# EAGLE design Chiqoo2 (EAGLE 6.6.0)
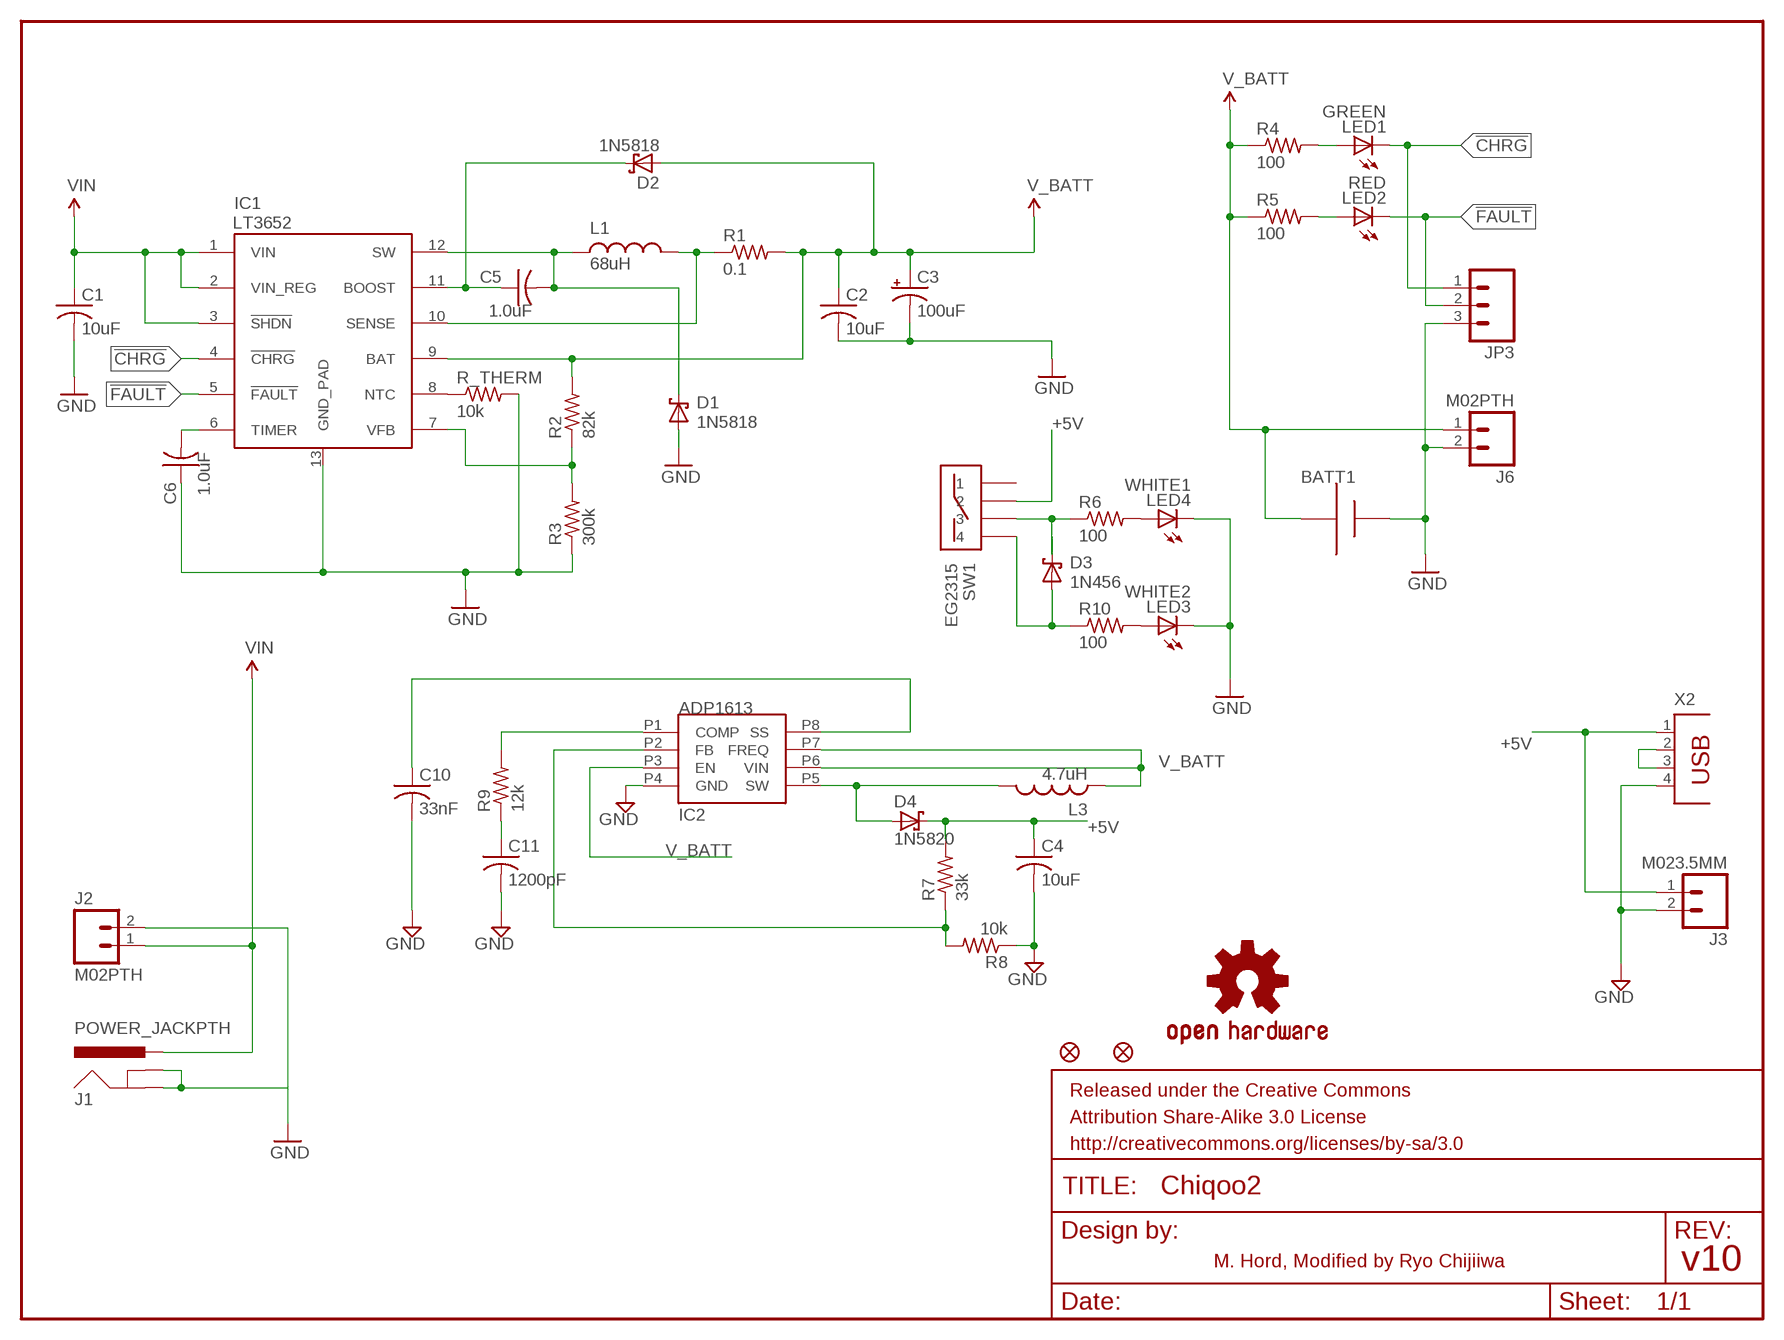
[diagram p0: schematic, sheet 1]

## Parts
BATT1  18650-HOLDER  [BK-18650-PC2]
C1  10uF  C-US050-024X044  [C050-024X044]
C2  10uF  C-US050-024X044  [C050-024X044]
C3  100uF  CPOL-USE5-5  [E5-5]
C4  10uF  C-US050-024X044  [C050-024X044]
C5  1.0uF  C-US025-025X050  [C025-025X050]
C6  1.0uF  C-US025-025X050  [C025-025X050]
C10  33nF  C-US050-024X044  [C050-024X044]
C11  1200pF  C-US025-025X050  [C025-025X050]
D1  1N5818  SCHOTTKY-DIODEDIODE-5  [DIODE-5]
D2  1N5818  SCHOTTKY-DIODEDIODE-5  [DIODE-5]
D3  1N456  SCHOTTKY-DIODEDIODE-5  [DIODE-5]
D4  1N5820  SCHOTTKY-DIODE  [DIODE]
FID1  FIDUCIAL1X2  [FIDUCIAL-1X2]
FID2  FIDUCIAL1X2  [FIDUCIAL-1X2]
FRAME1  FRAME-LETTER  [CREATIVE_COMMONS]
IC1  LT3652  [MSOP-12_GND]
IC2  ADP1613  [RM-8]
J1  POWER_JACKPTH  [POWER_JACK_PTH]
J2  M02PTH  [1X02]
J3  M023.5MM  [SCREWTERMINAL-3.5MM-2]
J6  M02PTH  [1X02]
JP3  M03PTH  [1X03]
L1  68uH  L-5MM-THRUHOLE  [L-5MM-THRUHOLE]
L3  4.7uH  L-5MM-THRUHOLE  [L-5MM-THRUHOLE]
LED1  GREEN  LED3MM  [LED3MM]
LED2  RED  LED3MM  [LED3MM]
LED3  WHITE2  LED5MM  [LED5MM]
LED4  WHITE1  LED5MM  [LED5MM]
LOGO2  OSHW-LOGOM  [OSHW-LOGO-M]
R1  0.1  R-US_0204/5  [0204/5]
R2  82k  R-US_0204/5  [0204/5]
R3  300k  R-US_0204/5  [0204/5]
R4  100  R-US_0204/5  [0204/5]
R5  100  R-US_0204/5  [0204/5]
R6  100  R-US_0204/5  [0204/5]
R7  33k  R-US_0204/5  [0204/5]
R8  10k  R-US_0204/5  [0204/5]
R9  12k  R-US_0204/5  [0204/5]
R10  100  R-US_0204/5  [0204/5]
R_THERM  10k  R-US_0204/5  [0204/5]
SW1  EG2315  [EG2315]
X2  PN87520  [PN87520]

## Nets
5V1: D4.ANNODE(A) IC2.P5(SW) L3.2
!CHRG: IC1.4(!CHRG) JP3.1 LED1.K(C)
!FAULT: IC1.5(!FAULT) JP3.2 LED2.K(C)
+5V: C4.1 D4.CATHODE(C) J3.1 R7.2 SW1.2 SW1.6 X2.1
BOOST: C5.1 D2.C IC1.11(BOOST)
FB: IC1.7(VFB) R2.1 R3.2
GND: BATT1.-(--) C1.2 C2.2 C3.- C4.2 C6.1 C10.2 C11.2 D1.A IC1.13(GND_PAD) IC2.P4(GND) J1.GND J1.GNDBREAK J2.2 J3.2 J6.2 JP3.3 LED3.K(C) LED4.K(C) R3.1 R8.1 R_THERM.2 X2.4
N$2: IC1.8(NTC) R_THERM.1
N$3: LED1.A R4.2
N$4: IC2.P1(COMP) R9.2
N$5: LED2.A R5.2
N$6: X2.2 X2.3
N$8: C11.1 R9.1
N$9: IC2.P2(FB) R7.1 R8.2
N$10: C10.1 IC2.P8(SS)
N$11: D3.C R6.1 SW1.3 SW1.7
N$12: LED4.A R6.2
N$13: LED3.A R10.2
N$14: D3.A R10.1 SW1.4 SW1.8
SENSE: IC1.10(SENSE) L1.2 R1.1
SW: C5.2 D1.C IC1.12(SW) L1.1
TIMER: C6.2 IC1.6(TIMER)
V_BATT: BATT1.+(++) C2.1 C3.+ D2.A IC1.9(BAT) IC2.P3(EN) IC2.P6(VIN) IC2.P7(FREQ) J6.1 L3.1 R1.2 R2.2 R4.1 R5.1
VIN: C1.1 IC1.1(VIN) IC1.2(VIN_REG) IC1.3(!SHDN) J1.PWR J2.1
Unconnected: SW1.1 SW1.5

## Notes on the sheet
- M. Hord, Modified by Ryo Chijiiwa | v10

## Library data of the parts
BATT1 = bootstrapsolar:18650-HOLDER: 18650 holder
C1 C2 C4-C6 = adafruit:C-US: CAPACITOR, American symbol
C3 = adafruit:CPOL-US: POLARIZED CAPACITOR, American symbol
C10 C11 = resistor:C-US: CAPACITOR, American symbol
D1-D4 = bootstrapsolar:SCHOTTKY-DIODE: Schottky diode. 1N5820 to 1N5822. 1.4mm holes spaced 12mm apart.
FID1 FID2 = SparkFun-Aesthetics:FIDUCIAL: Fiducial Alignment Points Various fiducial points for machine vision alignment.
FRAME1 = SparkFun-Aesthetics:FRAME-LETTER: Schematic Frame Standard 8.5x11 US Letter frame
IC1 = bootstrapsolar:LT3652: LT3652 MPPT Solar Charge Controller 5V-32V smart charger for batteries up to 14.4V
IC2 = bootstrapsolar:ADP1613
J1 = SparkFun-Connectors:POWER_JACK: Power Jack This is the standard 5.5mm barrel jack for power. The PTH is the most common, proven, reliable, footprint. The Slot footprint only works if the mill layer is transmitted to the PCB fab house so be warned. Spark Fun Electronics SKU : PRT-00119 SMT: CONN-08106 Mating wall wart : TOL-00298 (and others)
J2 J3 J6 = SparkFun-Connectors:M02: Standard 2-pin 0.1" header. Use with - straight break away headers ( PRT-00116) - right angle break away headers (PRT-00553) - swiss pins (PRT-00743) - machine pins (PRT-00117) - female headers (PRT-00115) Molex polarized connector foot print use with: PRT-08233 with associated crimp pins and housings. 2.54_SCREWTERM for use with PRT-10571. 3.5mm Screw Terminal footprints for PRT-08084 5mm Screw Terminal footprints for use with PRT-08433
JP3 = SparkFun-Connectors:M03: Header 3 Standard 3-pin 0.1" header. Use with straight break away headers (SKU : PRT-00116), right angle break away headers (PRT-00553), swiss pins (PRT-00743), machine pins (PRT-00117), and female headers (PRT-00115). Molex polarized connector foot print use with SKU : PRT-08232 with associated crimp pins and housings.
L1 L3 = bootstrapsolar:L-5MM-THRUHOLE: Inductor, thru hole. 5mm between pins, 9mm radius.
LED1-LED4 = adafruit:LED: LED OSRAM: - CHIPLED LG R971, LG N971, LY N971, LG Q971, LY Q971, LO R971, LY R971 LH N974, LH R974 LS Q976, LO Q976, LY Q976 LO Q996 - Hyper CHIPLED LW Q18S LB Q993, LB Q99A, LB R99A - SideLED LS A670, LO A670, LY A670, LG A670, LP A670 LB A673, LV A673, LT A673, LW A673 LH A674 LY A675 LS A676, LA A676, LO A676, LY A676, LW A676 LS A679, LY A679, LG A679 - Hyper Micro SIDELED® LS Y876, LA Y876, LO Y876, LY Y876 LT Y87S - SmartLED LW L88C, LW L88S LB L89C, LB L89S, LG L890 LS L89K, LO L89K, LY L89K LS L896, LA L896, LO L896, LY L896 - TOPLED LS T670, LO T670, LY T670, LG T670, LP T670 LSG T670, LSP T670, LSY T670, LOP T670, LYG T670 LG T671, LOG T671, LSG T671 LB T673, LV T673, LT T673, LW T673 LH T674 LS T676, LA T676, LO T676, LY T676, LB T676, LH T676, LSB T676, LW T676 LB T67C, LV T67C, LT T67C, LS T67K, LO T67K, LY T67K, LW E67C LS E67B, LA E67B, LO E67B, LY E67B, LB E67C, LV E67C, LT E67C LW T67C LS T679, LY T679, LG T679 LS T770, LO T770, LY T770, LG T770, LP T770 LB T773, LV T773, LT T773, LW T773 LH T774 LS E675, LA E675, LY E675, LS T675 LS T776, LA T776, LO T776, LY T776, LB T776 LHGB T686 LT T68C, LB T68C - Hyper Mini TOPLED® LB M676 - Mini TOPLED Santana® LG M470 LS M47K, LO M47K, LY M47K Source: http://www.osram.convergy.de/
LOGO2 = SparkFun-Aesthetics:OSHW-LOGO: Open Source Hardware Logo This logo indicates the piece of hardware it is found on incorporates a OSHW license and/or adheres to the definition of open source hardware found here: http://freedomdefined.org/OSHW
R1-R10 R_THERM = adafruit:R-US_: RESISTOR, American symbol
SW1 = bootstrapsolar:EG2315: 3 position (on-on-on) switch. EG1913, EG2315. When in position 1, Pin 1 and 2 are connected. In position 2, Pin 2 and 3 are connected. In position 3, Pin 2 and 4 are connected.
X2 = bootstrapsolar:PN87520: BERG USB connector; OC_FARNELL: unknown; OC_NEWARK: unknown

## Board
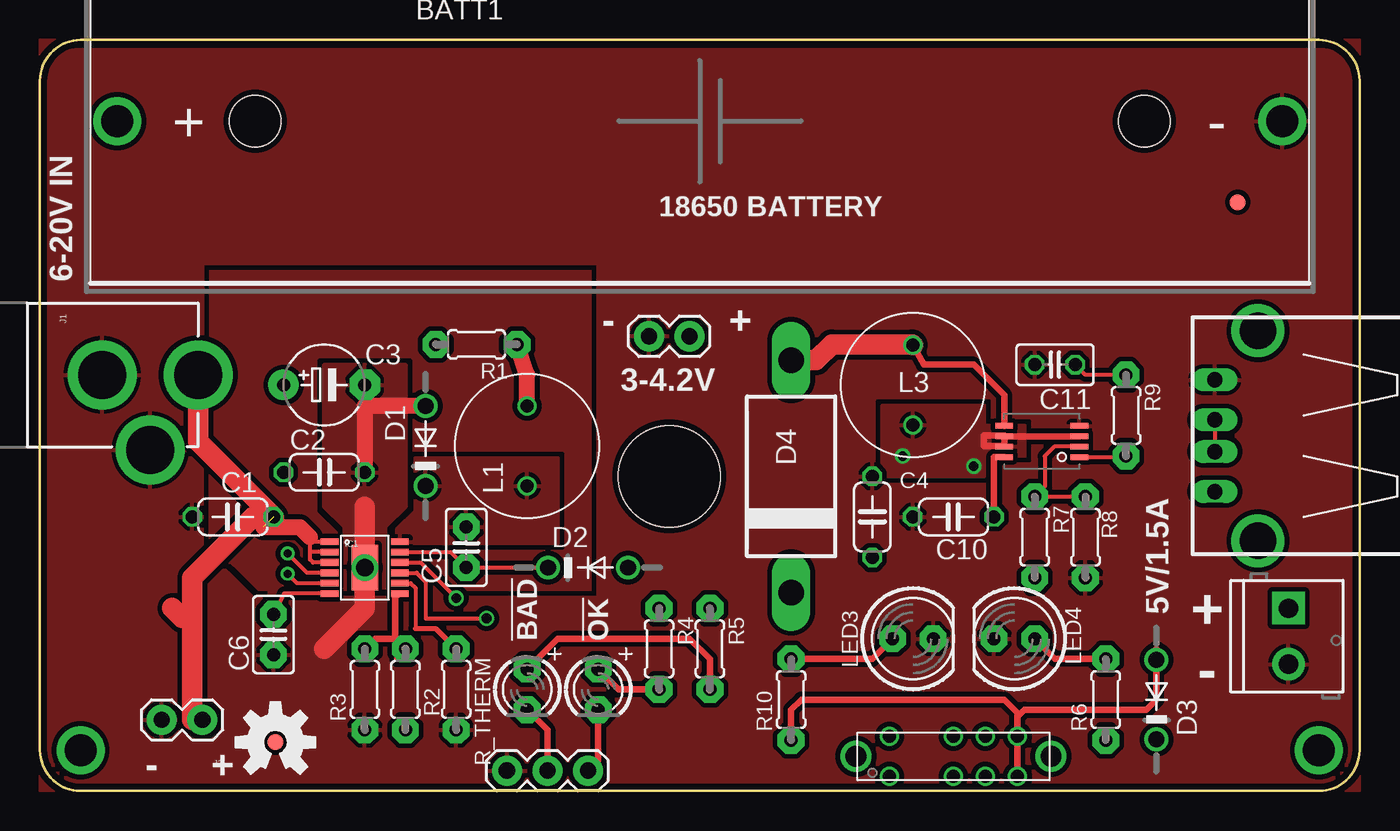
[diagram p1: board, top side]
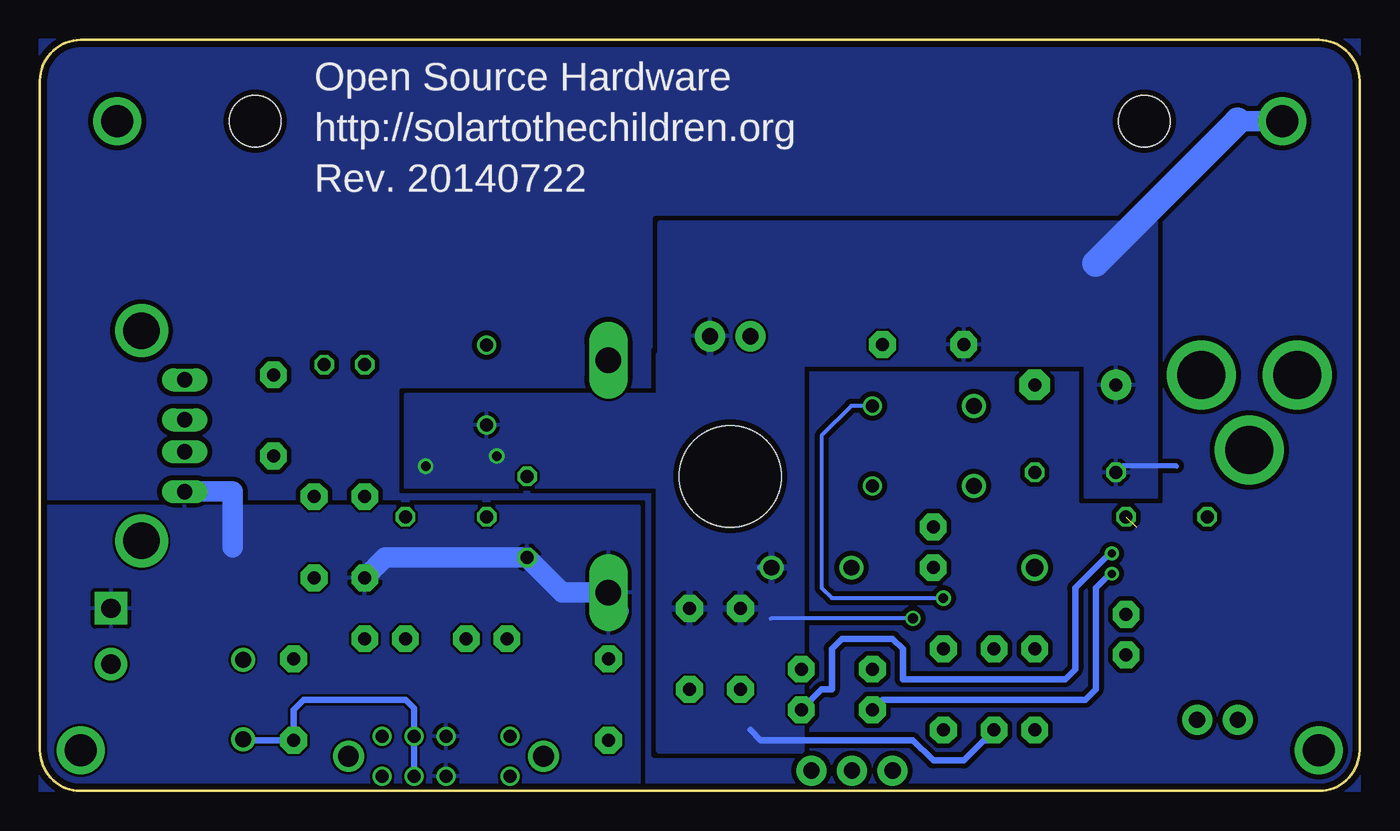
[diagram p2: board, bottom side, seen from below]

Size 82.55 x 46.99 mm. Coordinates in mm from the lower left corner, seen from the top.
Outline: 2.54,46.99 80.01,46.99 arc-90 82.55,44.45 82.55,2.54 arc-90 80.01,0 2.54,0 arc-90 0,2.54 0,44.45 arc-90 2.54,46.99
Copper layers (1*16): Top 0.0356mm / dielectric 1.5011mm / Bottom 0.0356mm
Design rules "LaenPCBOrder": minimum track width 6mil, minimum drill 13mil, track to track 6mil, track to pad 6mil, pad to pad 6mil, via to via 6mil, smd to smd 6mil, copper to edge 15mil, drill to drill 6mil, minimum pad ring 7mil, minimum via ring 7mil, stop-mask expansion 3mil, vias tented up to drill 0mil, thermal gap 10mil
Holes 6.35 mm at 39.37,19.68

### Footprints (pad centres in the part's own frame; a part is rotated, then mirrored left to right if it is on the bottom)
BK-18650-PC2 = drill 2: + -36.449,0; - 36.449,0 | hole 3.2: -27.813,0; 27.813,0
C050-024X044 = drill 0.813 octagon: 1 -2.54,0; 2 2.54,0
E5-5 = drill 0.813 pad 1.905: + -2.54,0 | drill 0.813 pad 1.905 octagon: - 2.54,0
C025-025X050 = drill 0.813 pad 1.676 octagon: 1 -1.27,0; 2 1.27,0
C025-025X050' = drill 0.813 octagon: 1 -1.27,0; 2 1.27,0
DIODE-5 = drill 1: A 2.5,0; C -2.5,0
DIODE = drill 1.6 long: ANNODE -7.27,0; CATHODE 7.27,0
FIDUCIAL-1X2 = smd 1 x 1: 1 0,0
MSOP-12_GND = smd 1.1 x 0.42: 1 -2.2,1.625; 2 -2.2,0.975; 3 -2.2,0.325; 4 -2.2,-0.325; 5 -2.2,-0.975; 6 -2.2,-1.625; 7 2.2,-1.625; 8 2.2,-0.975; 9 2.2,-0.325; 10 2.2,0.325; 11 2.2,0.975; 12 2.2,1.625 | smd 1.651 x 2.845: 13 0,0 | drill 1.1: P$1 0,0
RM-8 = smd 1.1 x 0.35: P1 -4.7,0.7; P2 -4.7,0.05; P3 -4.7,-0.6; P4 -4.7,-1.25; P5 0,-1.25; P6 0,-0.6; P7 0,0.05; P8 0,0.7
POWER_JACK_PTH = drill 2.997 pad 4.318: GND 0,7.7; GNDBREAK 4.7,10.7; PWR 0,13.7
1X02 = drill 1.016 pad 1.88: 1 0,0; 2 2.54,0
SCREWTERMINAL-3.5MM-2 = drill 1.2 pad 2.032 square: 1 0,0 | drill 1.2 pad 2.032: 2 3.5,0
1X03 = drill 1.016 pad 1.88: 1 0,0; 2 2.54,0; 3 5.08,0
L-5MM-THRUHOLE = drill 0.8: 1 -2.5,0; 2 2.5,0
LED3MM = drill 0.813 pad 1.676 octagon: A -1.27,0; K 1.27,0
LED5MM = drill 0.813 pad 1.676 octagon: A -1.27,0; K 1.27,0
0204/5 = drill 0.813 pad 1.676 octagon: 1 -2.54,0; 2 2.54,0
EG2315 = drill 0.8: 1 -4,-1.25; 2 0,-1.25; 3 2,-1.25; 4 4,-1.25; 5 -4,1.25; 6 0,1.25; 7 2,1.25; 8 4,1.25 | drill 1.3: S1 -6.1,0; S2 6.1,0
PN87520 = drill 0.95 long: 1 -3.5,2.71; 2 -1,2.71; 3 1,2.71; 4 3.5,2.71 | drill 2.3: P$1 -6.57,0; P$2 -6.57,0; P$3 6.57,0

### Placement (x,y rotation side)
BATT1  41.27,41.91 0 top
C1  12.06,17.14 180 top
C2  17.78,19.94 0 top
C3  17.78,25.4 0 top
C4  52.07,17.14 90 top
C5  26.67,15.24 90 top
C6  14.61,9.78 90 top
C10  57.15,17.14 180 top
C11  1200pF  [C025-025X050']  63.5,26.67 180 top
D1  24.13,21.59 90 top
D2  34.29,13.97 0 top
D3  69.85,5.71 90 top
D4  46.99,19.68 270 top
FID1  14.73,3.05 0 top
FID2  74.93,36.83 0 top
FRAME1  46.99,-26.67 0 top  (outside the outline)
IC1  20.32,13.97 0 top
IC2  60.33,21.59 180 top
J1  -3.81,26.04 270 top
J2  10.16,4.45 180 top
J3  78.11,11.43 270 top
J6  40.64,28.45 180 top
JP3  34.29,1.27 180 top
L1  30.48,21.59 90 top
L3  54.61,25.4 90 top
LED1  34.92,6.35 270 top
LED2  30.48,6.35 270 top
LED3  54.61,9.53 0 top
LED4  60.96,9.53 180 top
LOGO2  14.73,3.05 0 top
R1  27.3,27.94 180 top
R2  22.86,6.35 270 top
R3  20.32,6.35 90 top
R4  38.73,8.89 270 top
R5  41.91,8.89 270 top
R6  66.67,5.71 90 top
R7  62.23,15.88 270 top
R8  65.41,15.88 90 top
R9  67.94,23.5 270 top
R10  46.99,5.71 90 top
R_THERM  26.04,6.35 270 top
SW1  57.15,2.16 0 top
X2  76.2,22.23 90 top

### Tracks (layer width: path | path; a pad name or v marks a point on that pad's centre or on a via)
5V1
  Top 0.406: IC2.P5 60.33,24.77 58.42,26.67 55.28,26.67 L3.2
  Top 1.27: D4.ANNODE 48.55,26.95 49.53,27.94 54.57,27.94 L3.2
!CHRG  (via drill 0.51)
  Top 0.254: IC1.4 16.71,13.64 v15.49,14.86
  Top 0.406: LED1.K 34.92,1.91 JP3.1
  Bottom 0.406: v15.49,14.86 15.62,14.86 17.78,12.7 17.78,7.62 18.41,6.99 28.57,6.99 28.57,8.89 29.21,9.53 32.38,9.53 33.02,8.89 33.02,6.35 33.66,6.35 LED1.K
!FAULT  (via drill 0.51)
  Top 0.254: IC1.5 16.09,12.99 v15.49,13.59
  Top 0.406: LED2.K 31.75,3.81 JP3.2
  Bottom 0.406: v15.49,13.59 15.62,13.59 16.51,12.7 16.51,6.35 17.14,5.71 29.84,5.71 LED2.K
+5V
  Bottom 1.27: 46.35,11.28 D4.CATHODE 49.88,12.41 C4.1 60.96,14.61 R7.2 | X2.1 70.48,18.73 70.48,15.24
  pour Bottom: 45.09,17.78 82.55,17.78 82.55,0 45.09,0
BOOST
  Top 0.254: IC1.11 25.7,14.95 C5.1 D2.C
BOTTOM
  pour Bottom (isolate 0.305, rank 3, no thermals): 0,46.99 82.55,46.99 82.55,0 0,0
FB
  Top 0.406: 22.35,8.26 R2.1 22.23,9.53 | IC1.7 22.23,12.15 22.23,9.53 | 22.23,9.53 20.95,9.53 R3.2
GND
  Top 1.016: D1.A 20.32,24.09 C2.2
  Top 1.27: 20.32,17.78 20.32,11.43 17.78,8.89
  pour Top (isolate 0.305, rank 2): 82.55,46.35 0,46.35 0,33.02 34.92,33.02 34.92,12.06 13.34,12.06 10.16,15.24 10.16,30.48 0,30.48 0,0 82.55,0
  pour Top (isolate 0.305): 22.86,26.67 22.86,17.78 21.59,16.51 21.59,12.7 19.05,12.7 19.05,16.51 17.78,17.78 17.78,26.67
  pour Top (isolate 0.305, rank 2): 0,38.73 10.16,38.73 10.16,21.59 0,21.59
N$1
  pour Top (isolate 0.305, rank 3, no thermals): 0,46.99 82.55,46.99 82.55,0 0,0
N$2
  Top 0.254: IC1.8 23.2,12.99 23.5,12.7 23.5,10.16
  Top 0.305: 23.5,10.16 24.77,10.16 R_THERM.1
N$3
  Top 0.406: R4.2 36.2,6.35 LED1.A
N$4
  Top 0.254: IC2.P1 67.88,20.89 R9.2
N$5
  Top 0.406: R5.2 41.91,8.26 40.64,9.53 32.38,9.53 LED2.A
N$6
  Top 0.254: X2.3 X2.2
N$7  (via drill 2)
  other vias: 2.54,2.54
N$8
  Top 0.254: R9.1 65.41,26.04 C11.1
N$9
  Top 0.254: R8.2 R7.1 62.87,19.05 62.87,20.95 63.45,21.54 IC2.P2
N$10
  Top 0.406: IC2.P8 59.69,20.89 C10.1
N$11
  Bottom 0.406: SW1.3 SW1.7 59.15,5.17 59.69,5.71 66.04,5.71 66.67,5.08 R6.1 69.81,3.17 D3.C
N$12
  Top 0.406: R6.2 63.5,8.26 LED4.A
N$13
  Top 0.406: 52.7,8.89 LED3.A 52.07,8.26 R10.2
N$14
  Top 0.406: SW1.4 SW1.8 | SW1.8 61.15,4.63 61.59,5.08 69.22,5.08 69.85,5.71 D3.A 69.85,8.89 | SW1.8 61.15,4.89 60.33,5.71 47.62,5.71 46.99,5.08 R10.1
N$15  (via drill 2)
  other vias: 80.01,2.54
SENSE  (via drill 0.6)
  Top 0.254: IC1.10 23.8,14.29 v26.04,12.06
  Top 1.016: L1.2 30.48,26.04 R1.1
  Bottom 0.254: L1.2 31.79,24.09 33.66,22.23 33.66,12.7 33.02,12.06 v26.04,12.06
SW
  pour Top (isolate 0.305): 23.5,20.83 32.38,20.83 32.38,15.49 22.35,15.49 22.35,16.38 23.5,17.53
TIMER
  Top 0.254: IC1.6 15.27,12.35 C6.2
V_BATT  (via drill 0.6)
  Top 0.254: v27.94,10.79 24.13,10.79 24.13,13.08 23.57,13.64 IC1.9
  Top 0.406: IC2.P3 IC2.P6 | 60.33,22.23 60.33,21.59 59.05,21.59 59.05,22.23 60.33,22.23
  Bottom 0.254: v27.94,10.79 36.83,10.79
  Bottom 0.305: 11.43,20.32 14.86,20.32 C2.1
  Bottom 0.406: D2.A 37.47,13.97 | R2.2 22.86,3.17 23.5,3.17 24.77,1.91 26.67,1.91 27.94,3.17 37.47,3.17 38.1,3.81
  Bottom 1.27: BATT1.+ 7.62,41.91
  Bottom 1.676: 7.62,41.91 16.51,33.02
  other vias: 58.42,20.32 53.98,20.95
  pour Bottom: 13.34,35.56 43.81,35.56 43.81,34.92 43.81,26.67 12.7,26.67 12.7,35.56
  pour Bottom: 12.7,29.21 17.14,29.21 17.14,18.41 12.7,18.41
  pour Bottom: 34.92,27.3 34.92,2.54 43.81,2.54 43.81,27.3
  pour Top (isolate 0.305): 61.59,20.95 59.05,20.95 59.05,19.68 52.7,19.68 52.7,24.13 59.05,24.13 59.05,22.86 61.59,22.86
  pour Bottom: 42.55,24.77 59.69,24.77 59.69,19.05 42.55,19.05
VIN  (1 unrouted)
  Top 0.254: IC1.1 17.17,15.6 16.89,15.88 16.89,14.99 | IC1.3 17.07,14.29 16.89,14.48 16.89,14.99 | IC1.2 16.93,14.95 16.89,14.99
  Top 1.016: 13.97,16.51 16.26,16.51 16.89,15.88
  Top 1.27: J1.PWR 9.89,21.86 C1.1 13.34,17.14 9.53,13.34 9.53,11.43 | 9.53,11.43 9.53,4.45 J2.1 | 9.53,11.43 8.91,10.81 8.28,11.45

### Text on the board
tPlace: 18650 BATTERY | 6-20V IN | - | + | 3-4.2V | 5V/1.5A | + | !BAD | !OK | - | - | +
bPlace: Open Source Hardware | http://solartothechildren.org | Rev. 20140722
tDocu: M. Hord, Modified by R. Chijiiwa